# Altium schematic sheet Power Supply Page for RK3399.SchDoc
size A3; SheetNumber: 8; SheetTotal: 26
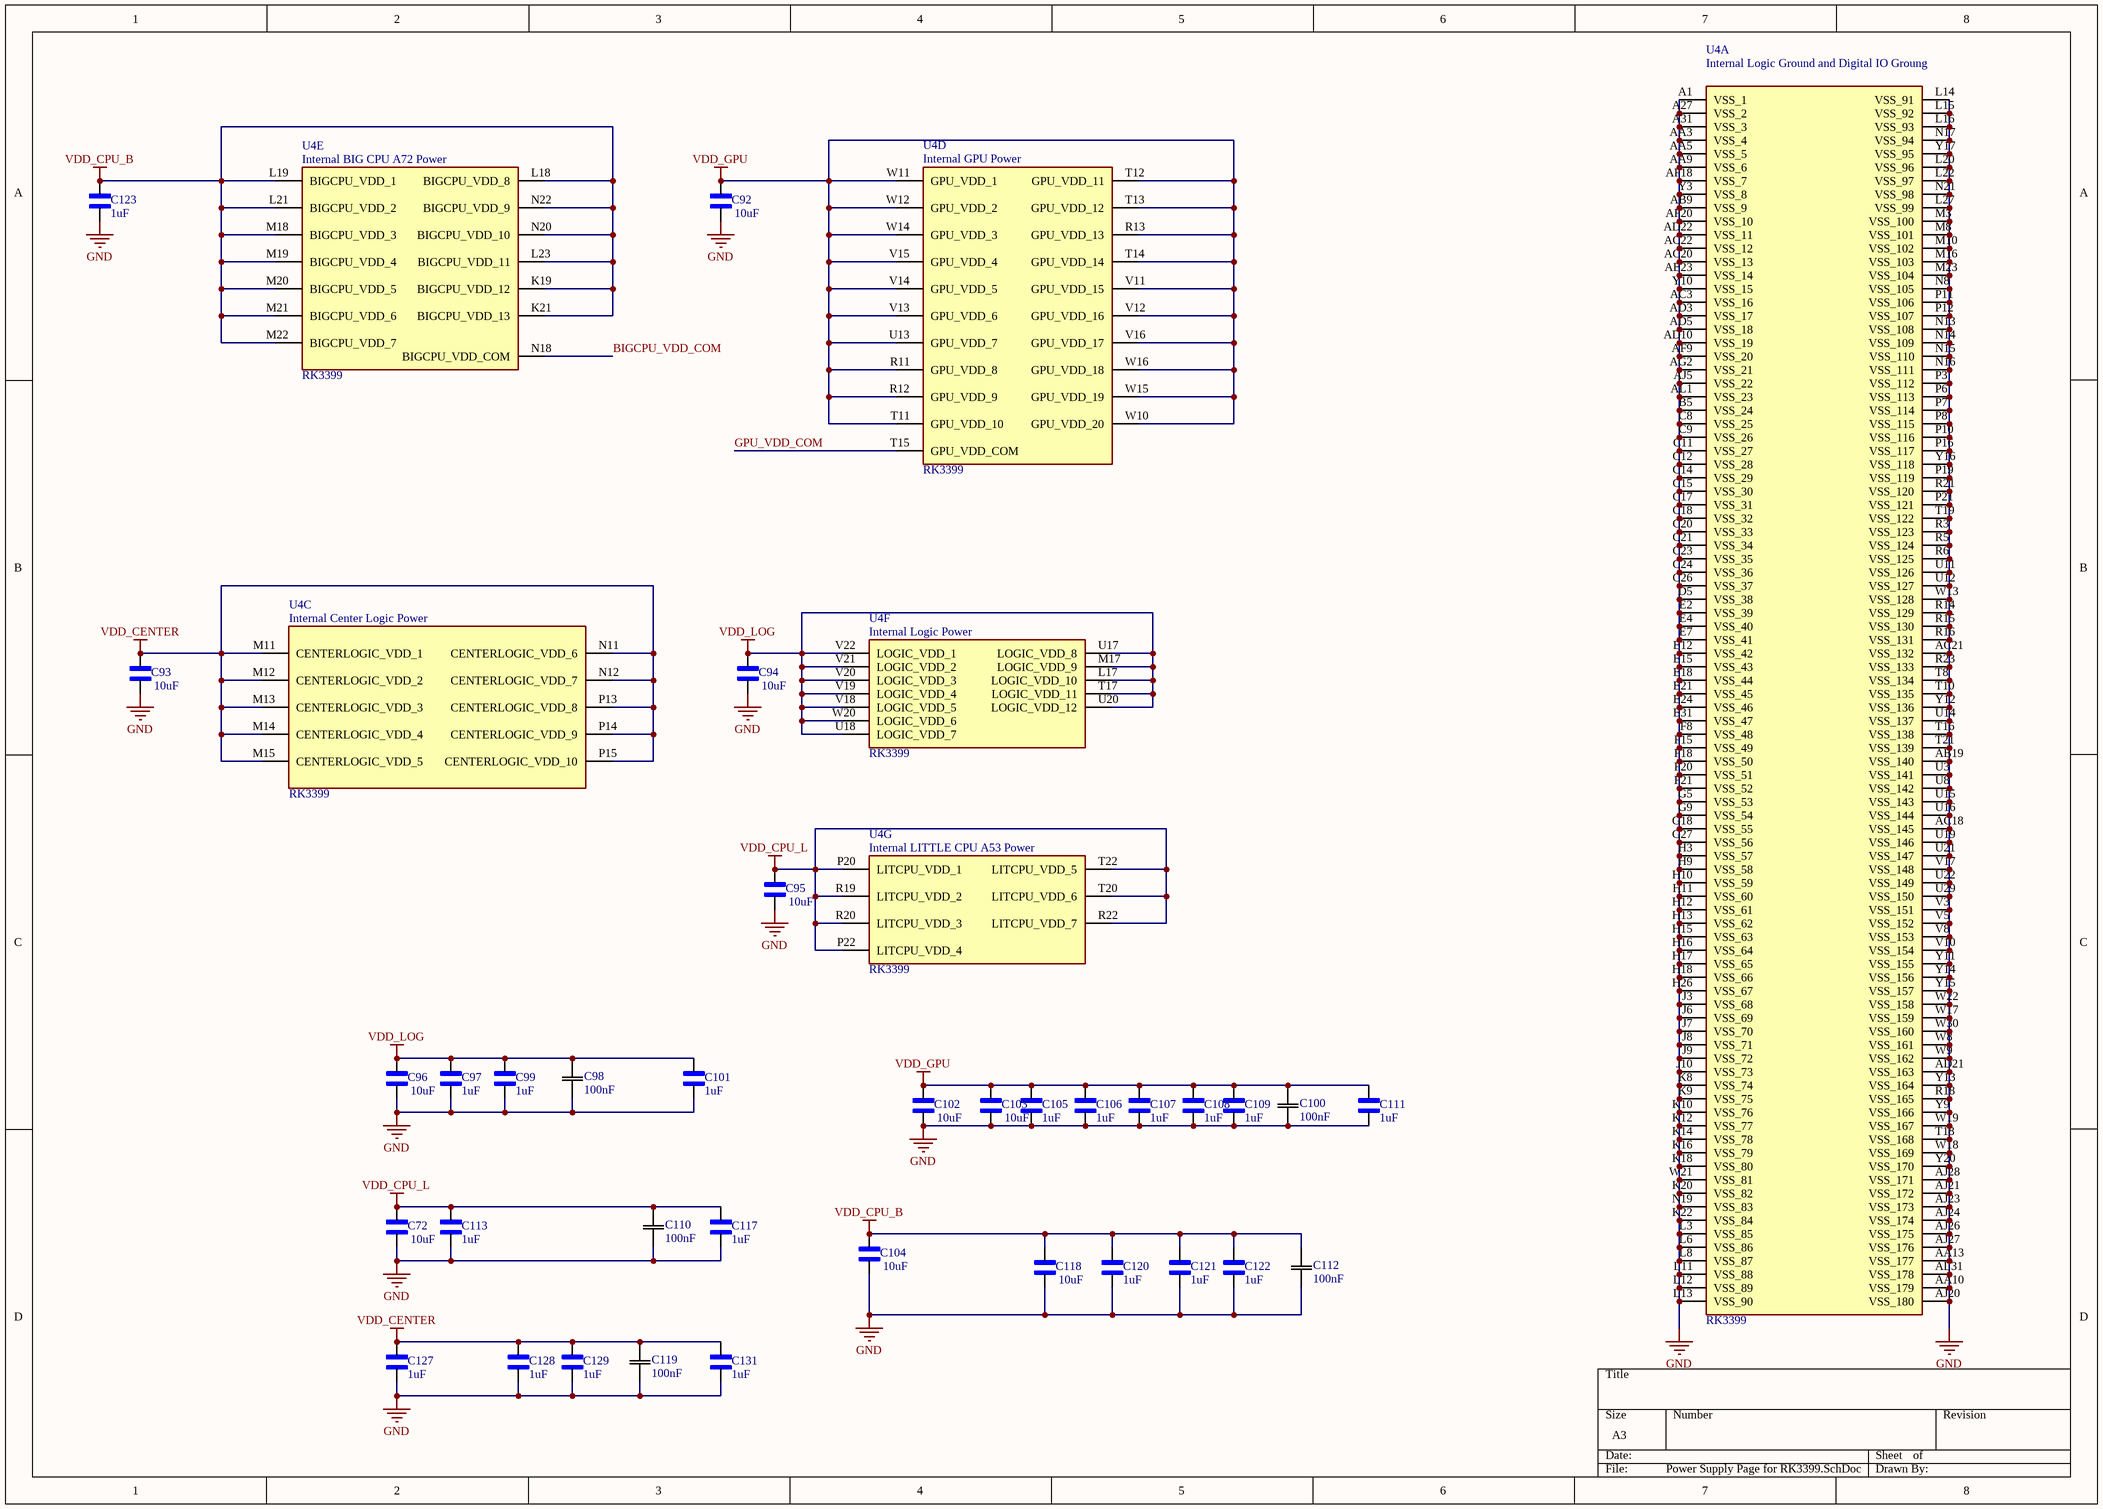
[diagram p0: Power Supply Page for RK3399.SchDoc]

## Parts
C72  10uF  [CAPC1005X70N]
C92  10uF  [CAPC1005X70N]
C93  10uF  [CAPC1005X70N]
C94  10uF  [CAPC1005X70N]
C95  10uF  [CAPC1005X70N]
C96  10uF  [CAPC1005X70N]
C97  1uF  [CAPC1005X56N]
C98  100nF  [CAP_1005_TDK]
C99  1uF  [CAPC1005X56N]
C100  100nF  [CAP_1005_TDK]
C101  1uF  [CAPC1005X56N]
C102  10uF  [CAPC1005X70N]
C103  10uF  [CAPC1005X70N]
C104  10uF  [CAPC1005X70N]
C105  1uF  [CAPC1005X56N]
C106  1uF  [CAPC1005X56N]
C107  1uF  [CAPC1005X56N]
C108  1uF  [CAPC1005X56N]
C109  1uF  [CAPC1005X56N]
C110  100nF  [CAP_1005_TDK]
C111  1uF  [CAPC1005X56N]
C112  100nF  [CAP_1005_TDK]
C113  1uF  [CAPC1005X56N]
C117  1uF  [CAPC1005X56N]
C118  10uF  [CAPC1005X70N]
C119  100nF  [CAP_1005_TDK]
C120  1uF  [CAPC1005X56N]
C121  1uF  [CAPC1005X56N]
C122  1uF  [CAPC1005X56N]
C123  1uF  [CAPC1005X56N]
C127  1uF  [CAPC1005X56N]
C128  1uF  [CAPC1005X56N]
C129  1uF  [CAPC1005X56N]
C131  1uF  [CAPC1005X56N]
U4  RK3399  [BGA828C65P31X31_2100X2100X161N]  (parts A,C,D,E,F,G of 32)

## Nets
GND: C72.1 C92.1 C93.1 C94.1 C95.1 C96.1 C97.1 C98.1 C99.1 C100.1 C101.1 C102.1 C103.1 C104.1 C105.1 C106.1 C107.1 C108.1 C109.1 C110.1 C111.1 C112.1 C113.1 C117.1 C118.1 C119.1 C120.1 C121.1 C122.1 C123.1 C127.1 C128.1 C129.1 C131.1 U4.A1(VSS_1) U4.A27(VSS_2) U4.A31(VSS_3) U4.AA3(VSS_4) U4.AA5(VSS_5) U4.AA9(VSS_6) U4.AA10(VSS_179) U4.AA13(VSS_177) U4.AB9(VSS_9) U4.AB19(VSS_140) U4.AC3(VSS_16) U4.AC18(VSS_145) U4.AC20(VSS_13) U4.AC21(VSS_132) U4.AC22(VSS_12) U4.AD3(VSS_17) U4.AD5(VSS_18) U4.AD10(VSS_19) U4.AD21(VSS_163) U4.AD22(VSS_11) U4.AE23(VSS_14) U4.AF9(VSS_20) U4.AF18(VSS_7) U4.AF20(VSS_10) U4.AG2(VSS_21) U4.AJ5(VSS_22) U4.AJ20(VSS_180) U4.AJ21(VSS_172) U4.AJ23(VSS_173) U4.AJ24(VSS_174) U4.AJ26(VSS_175) U4.AJ27(VSS_176) U4.AJ28(VSS_171) U4.AL1(VSS_23) U4.AL31(VSS_178) U4.B5(VSS_24) U4.C8(VSS_25) U4.C9(VSS_26) U4.C11(VSS_27) U4.C12(VSS_28) U4.C14(VSS_29) U4.C15(VSS_30) U4.C17(VSS_31) U4.C18(VSS_32) U4.C20(VSS_33) U4.C21(VSS_34) U4.C23(VSS_35) U4.C24(VSS_36) U4.C26(VSS_37) U4.D5(VSS_38) U4.E2(VSS_39) U4.E4(VSS_40) U4.E7(VSS_41) U4.E12(VSS_42) U4.E15(VSS_43) U4.E18(VSS_44) U4.E21(VSS_45) U4.E24(VSS_46) U4.E31(VSS_47) U4.F8(VSS_48) U4.F15(VSS_49) U4.F18(VSS_50) U4.F20(VSS_51) U4.F21(VSS_52) U4.G5(VSS_53) U4.G9(VSS_54) U4.G18(VSS_55) U4.G27(VSS_56) U4.H3(VSS_57) U4.H9(VSS_58) U4.H10(VSS_59) U4.H11(VSS_60) U4.H12(VSS_61) U4.H13(VSS_62) U4.H15(VSS_63) U4.H16(VSS_64) U4.H17(VSS_65) U4.H18(VSS_66) U4.H26(VSS_67) U4.J3(VSS_68) U4.J6(VSS_69) U4.J7(VSS_70) U4.J8(VSS_71) U4.J9(VSS_72) U4.J10(VSS_73) U4.K8(VSS_74) U4.K9(VSS_75) U4.K10(VSS_76) U4.K12(VSS_77) U4.K14(VSS_78) U4.K16(VSS_79) U4.K18(VSS_80) U4.K20(VSS_82) U4.K22(VSS_84) U4.L3(VSS_85) U4.L6(VSS_86) U4.L8(VSS_87) U4.L11(VSS_88) U4.L12(VSS_89) U4.L13(VSS_90) U4.L14(VSS_91) U4.L15(VSS_92) U4.L16(VSS_93) U4.L20(VSS_96) U4.L22(VSS_97) U4.L27(VSS_99) U4.M3(VSS_100) U4.M8(VSS_101) U4.M10(VSS_102) U4.M16(VSS_103) U4.M23(VSS_104) U4.N8(VSS_105) U4.N13(VSS_108) U4.N14(VSS_109) U4.N15(VSS_110) U4.N16(VSS_111) U4.N17(VSS_94) U4.N19(VSS_83) U4.N21(VSS_98) U4.P3(VSS_112) U4.P6(VSS_113) U4.P7(VSS_114) U4.P8(VSS_115) U4.P10(VSS_116) U4.P11(VSS_106) U4.P12(VSS_107) U4.P16(VSS_117) U4.P19(VSS_119) U4.P21(VSS_121) U4.R3(VSS_123) U4.R5(VSS_124) U4.R6(VSS_125) U4.R14(VSS_129) U4.R15(VSS_130) U4.R16(VSS_131) U4.R18(VSS_165) U4.R21(VSS_120) U4.R23(VSS_133) U4.T8(VSS_134) U4.T10(VSS_135) U4.T16(VSS_138) U4.T18(VSS_168) U4.T19(VSS_122) U4.T21(VSS_139) U4.U3(VSS_141) U4.U8(VSS_142) U4.U11(VSS_126) U4.U12(VSS_127) U4.U14(VSS_137) U4.U15(VSS_143) U4.U16(VSS_144) U4.U19(VSS_146) U4.U21(VSS_147) U4.U22(VSS_149) U4.U29(VSS_150) U4.V3(VSS_151) U4.V5(VSS_152) U4.V8(VSS_153) U4.V10(VSS_154) U4.V17(VSS_148) U4.W8(VSS_161) U4.W9(VSS_162) U4.W13(VSS_128) U4.W17(VSS_159) U4.W18(VSS_169) U4.W19(VSS_167) U4.W21(VSS_81) U4.W22(VSS_158) U4.W30(VSS_160) U4.Y3(VSS_8) U4.Y9(VSS_166) U4.Y10(VSS_15) U4.Y11(VSS_155) U4.Y12(VSS_136) U4.Y13(VSS_164) U4.Y14(VSS_156) U4.Y15(VSS_157) U4.Y16(VSS_118) U4.Y17(VSS_95) U4.Y20(VSS_170)
VDD_CENTER: C93.2 C119.2 C127.2 C128.2 C129.2 C131.2 U4.M11(CENTERLOGIC_VDD_1) U4.M12(CENTERLOGIC_VDD_2) U4.M13(CENTERLOGIC_VDD_3) U4.M14(CENTERLOGIC_VDD_4) U4.M15(CENTERLOGIC_VDD_5) U4.N11(CENTERLOGIC_VDD_6) U4.N12(CENTERLOGIC_VDD_7) U4.P13(CENTERLOGIC_VDD_8) U4.P14(CENTERLOGIC_VDD_9) U4.P15(CENTERLOGIC_VDD_10)
VDD_CPU_B: C104.2 C112.2 C118.2 C120.2 C121.2 C122.2 C123.2 U4.K19(BIGCPU_VDD_12) U4.K21(BIGCPU_VDD_13) U4.L18(BIGCPU_VDD_8) U4.L19(BIGCPU_VDD_1) U4.L21(BIGCPU_VDD_2) U4.L23(BIGCPU_VDD_11) U4.M18(BIGCPU_VDD_3) U4.M19(BIGCPU_VDD_4) U4.M20(BIGCPU_VDD_5) U4.M21(BIGCPU_VDD_6) U4.M22(BIGCPU_VDD_7) U4.N20(BIGCPU_VDD_10) U4.N22(BIGCPU_VDD_9)
VDD_CPU_L: C72.2 C95.2 C110.2 C113.2 C117.2 U4.P20(LITCPU_VDD_1) U4.P22(LITCPU_VDD_4) U4.R19(LITCPU_VDD_2) U4.R20(LITCPU_VDD_3) U4.R22(LITCPU_VDD_7) U4.T20(LITCPU_VDD_6) U4.T22(LITCPU_VDD_5)
VDD_GPU: C92.2 C100.2 C102.2 C103.2 C105.2 C106.2 C107.2 C108.2 C109.2 C111.2 U4.R11(GPU_VDD_8) U4.R12(GPU_VDD_9) U4.R13(GPU_VDD_13) U4.T11(GPU_VDD_10) U4.T12(GPU_VDD_11) U4.T13(GPU_VDD_12) U4.T14(GPU_VDD_14) U4.U13(GPU_VDD_7) U4.V11(GPU_VDD_15) U4.V12(GPU_VDD_16) U4.V13(GPU_VDD_6) U4.V14(GPU_VDD_5) U4.V15(GPU_VDD_4) U4.V16(GPU_VDD_17) U4.W10(GPU_VDD_20) U4.W11(GPU_VDD_1) U4.W12(GPU_VDD_2) U4.W14(GPU_VDD_3) U4.W15(GPU_VDD_19) U4.W16(GPU_VDD_18)
VDD_LOG: C94.2 C96.2 C97.2 C98.2 C99.2 C101.2 U4.L17(LOGIC_VDD_10) U4.M17(LOGIC_VDD_9) U4.T17(LOGIC_VDD_11) U4.U17(LOGIC_VDD_8) U4.U18(LOGIC_VDD_7) U4.U20(LOGIC_VDD_12) U4.V18(LOGIC_VDD_5) U4.V19(LOGIC_VDD_4) U4.V20(LOGIC_VDD_3) U4.V21(LOGIC_VDD_2) U4.V22(LOGIC_VDD_1) U4.W20(LOGIC_VDD_6)
BIGCPU_VDD_COM: U4.N18(BIGCPU_VDD_COM)
GPU_VDD_COM: U4.T15(GPU_VDD_COM)

## Notes on the sheet
- (in symbol RK3399, part A) Internal Logic Ground and Digital IO Groung
- (in symbol RK3399, part C) Internal Center Logic Power
- (in symbol RK3399, part D) Internal GPU Power
- (in symbol RK3399, part E) Internal BIG CPU A72 Power
- (in symbol RK3399, part F) Internal Logic Power
- (in symbol RK3399, part G) Internal LITTLE CPU A53 Power

## Library data of the parts
C72 C92-C96 C102-C104 C118 = CL05A106MQ5NUNC: 10 ÂµF Â±20% 6.3V Ceramic Capacitor X5R 0402 (1005 Metric); MF: Samsung; SnapEDA_Link: https://www.snapeda.com/parts/CL05A106MQ5NUNC/Samsung/view-part/?ref=snap; Package: SMD-2 Samsung; Value: *; MP: CL05A106MQ5NUNC; Check_prices: https://www.snapeda.com/parts/CL05A106MQ5NUNC/Samsung/view-part/?ref=eda
C97 C99 C101 C105-C109 C111 C113 C117 C120-C123 C127-C129 C131 = 0402ZD105KAT4A: 1 ÂµF Â±10% 10V Ceramic Capacitor X5R 0402 (1005 Metric); MF: AVX; SnapEDA_Link: https://www.snapeda.com/parts/0402ZD105KAT4A/AVX/view-part/?ref=snap; Package: 1005 AVX; Value: *; MP: 0402ZD105KAT4A; Check_prices: https://www.snapeda.com/parts/0402ZD105KAT4A/AVX/view-part/?ref=eda
C98 C100 C110 C112 C119 = C1005X7R1H104M050BB: Description; Manufacturer_Name: TDK; Copyright: Copyright (C) 2025 Ultra Librarian. All rights reserved.; Manufacturer_Part_Number: C1005X7R1H104M050BB
U4 = RK3399: RK3399 ROCK Pi 4 Model A 2GB - ARMÂ® CortexÂ®-A53, CortexÂ®-A72 MPU Embedded Evaluation Board; MF: Rockchip; SnapEDA_Link: https://www.snapeda.com/parts/RK3399/Fuzhou+Rockchip+Electronics+Co/view-part/?ref=snap; Package: Seeed Technology; MP: RK3399; Check_prices: https://www.snapeda.com/parts/RK3399/Fuzhou+Rockchip+Electronics+Co/view-part/?ref=eda; Price: None; Value: *; Availability: Not in stock